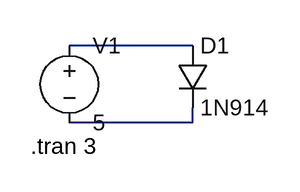
[diagram p0: schematic motorDriverSimTemp.asc]
motorDriverSimTemp.asc, the LTspice schematic file:
Version 4.1
SHEET 1 880 680
WIRE 272 -16 144 -16
WIRE 272 64 272 48
WIRE 272 64 144 64
SYMBOL voltage 144 -32 R0
WINDOW 123 0 0 Left 0
WINDOW 39 0 0 Left 0
SYMATTR InstName V1
SYMATTR Value 5
SYMBOL diode 256 -16 R0
SYMATTR InstName D1
SYMATTR Value 1N914
TEXT 104 88 Left 2 !.tran 3

The netlist it stands for:
* motorDriverSimTemp.asc
V1 N001 N002 5
D1 N001 N002 1N914
.model D D
.lib standard.dio
.tran 3
.backanno
.end